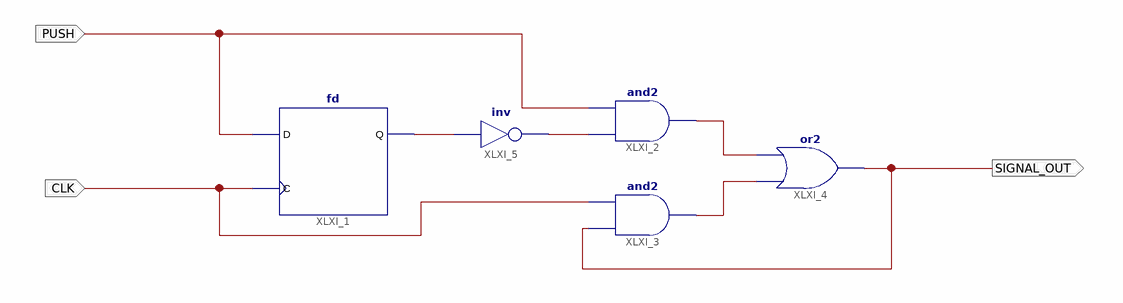
[diagram p0: schematic sheet 1]
// Xilinx ISE schematic clk_signal_sch.sch (spartan3e) as structural Verilog: 5 symbols, 3 ports
module clk_signal_sch (
  input  PUSH,
  input  CLK,
  output SIGNAL_OUT
);

  wire XLXN_1, XLXN_2, XLXN_5, XLXN_6;

  fd XLXI_1 (.C(CLK), .D(PUSH), .Q(XLXN_1));
  and XLXI_2 (XLXN_5, XLXN_2, PUSH);
  and XLXI_3 (XLXN_6, SIGNAL_OUT, CLK);
  or XLXI_4 (SIGNAL_OUT, XLXN_6, XLXN_5);
  not XLXI_5 (XLXN_2, XLXN_1);
endmodule
